# Altium schematic sheet Sheet1.SchDoc
size 594 x 420 mm; Author: ALTIUM GOSTBOM2.0 KEV; SheetNumber: 1; SheetTotal: 1
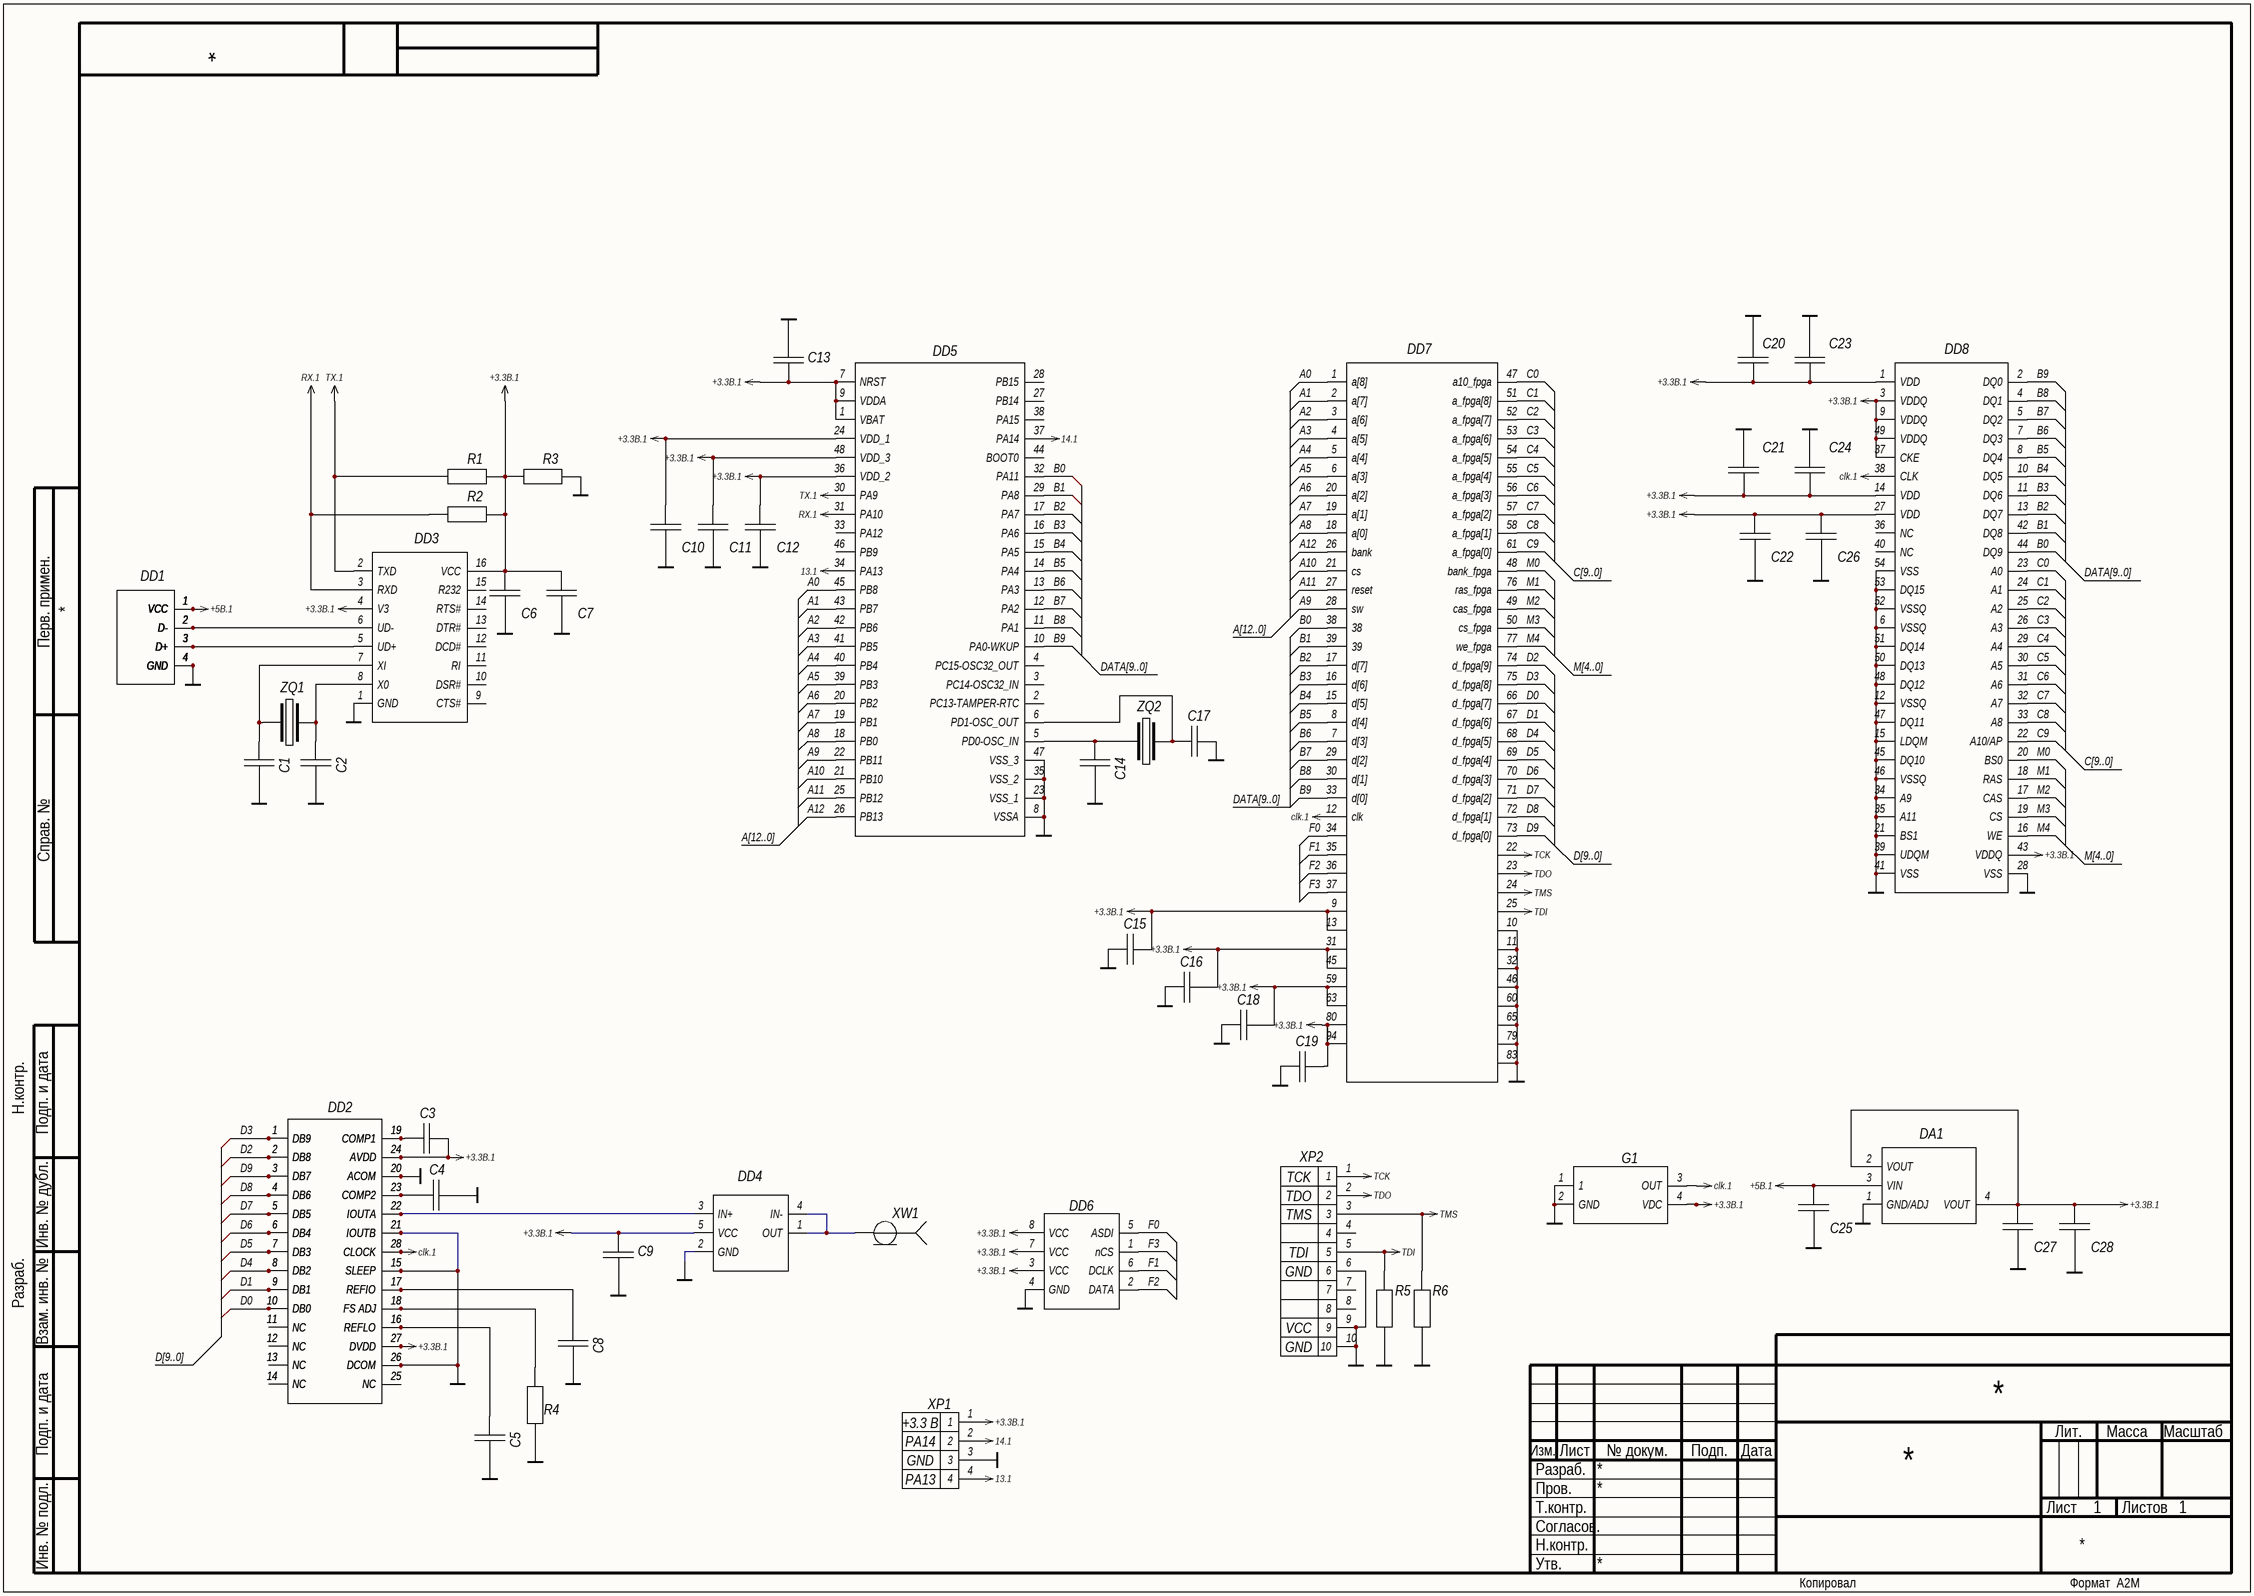
[diagram p0: Sheet1.SchDoc]

## Parts
C1  Обозначение при заказе  [CAP 0603_1608]  (value not drawn)
C2  Обозначение при заказе  [CAP 0603_1608]  (value not drawn)
C3  Обозначение при заказе  [CAP 0603_1608]  (value not drawn)
C4  Обозначение при заказе  [CAP 0603_1608]  (value not drawn)
C5  Обозначение при заказе  [CAP 0603_1608]  (value not drawn)
C6  Обозначение при заказе  [CAP 0603_1608]  (value not drawn)
C7  Обозначение при заказе  [CAP 0603_1608]  (value not drawn)
C8  Обозначение при заказе  [CAP 0603_1608]  (value not drawn)
C9  Обозначение при заказе  [CAP 0603_1608]  (value not drawn)
C10  Обозначение при заказе  [CAP 0603_1608]  (value not drawn)
C11  Обозначение при заказе  [CAP 0603_1608]  (value not drawn)
C12  Обозначение при заказе  [CAP 0603_1608]  (value not drawn)
C13  Обозначение при заказе  [CAP 0603_1608]  (value not drawn)
C14  Обозначение при заказе  [CAP 0603_1608]  (value not drawn)
C15  Обозначение при заказе  [CAP 0603_1608]  (value not drawn)
C16  Обозначение при заказе  [CAP 0603_1608]  (value not drawn)
C17  Обозначение при заказе  [CAP 0603_1608]  (value not drawn)
C18  Обозначение при заказе  [CAP 0603_1608]  (value not drawn)
C19  Обозначение при заказе  [CAP 0603_1608]  (value not drawn)
C20  Обозначение при заказе  [CAP 0603_1608]  (value not drawn)
C21  Обозначение при заказе  [CAP 0603_1608]  (value not drawn)
C22  Обозначение при заказе  [CAP 0603_1608]  (value not drawn)
C23  Обозначение при заказе  [CAP 0603_1608]  (value not drawn)
C24  Обозначение при заказе  [CAP 0603_1608]  (value not drawn)
C25  Обозначение при заказе  [CAP 0603_1608]  (value not drawn)
C26  Обозначение при заказе  [CAP 0603_1608]  (value not drawn)
C27  Обозначение при заказе  [CAP 0603_1608]  (value not drawn)
C28  Обозначение при заказе  [CAP 0603_1608]  (value not drawn)
DA1  Обозначение при заказе  [AMS1117-3.3 GENERATED]  (value not drawn)
DD1  USB  [USB]  (value not drawn)
DD2  Обозначение при заказе  [DAC]  (value not drawn)
DD3  Обозначение при заказе  [CH340G GENERATED]  (value not drawn)
DD4  AD8091  [SOT95P245X110-5N]  (value not drawn)
DD5  Обозначение при заказе  [LQFP-48]  (value not drawn)
DD6  Обозначение при заказе  [FLASH]  (value not drawn)
DD7  Обозначение при заказе  [QFP50P1600X1600X120-100N]  (value not drawn)
DD8  Обозначение при заказе  [SOP127P600-8N]  (value not drawn)
G1  Обозначение при заказе  [CAC-508P730X490-4N]  (value not drawn)
R1  Обозначение при заказе  [R_0805_T0.4]  (value not drawn)
R2  Обозначение при заказе  [R_0805_T0.4]  (value not drawn)
R3  Обозначение при заказе  [R_0805_T0.4]  (value not drawn)
R4  Обозначение при заказе  [R_0805_T0.4]  (value not drawn)
R5  Обозначение при заказе  [R_0805_T0.4]  (value not drawn)
R6  Обозначение при заказе  [R_0805_T0.4]  (value not drawn)
XP1  Обозначение при заказе  [4PIN]  (value not drawn)
XP2  Обозначение при заказе  [PINS]  (value not drawn)
XW1  Обозначение при заказе  [UHF]  (value not drawn)
ZQ1  Обозначение при заказе  [ECN-7U12000MAB143ZA3]  (value not drawn)
ZQ2  Обозначение при заказе  [ECN-7U12000MAB143ZA3]  (value not drawn)

## Nets
13.1: DD5.34(PA13) XP1.4
14.1: DD5.37(PA14) XP1.2
+3.3В.1: C3.2 C6.2 C7.2 C9.2 C10.2 C11.2 C12.2 C13.2 C15.2 C16.2 C18.2 C19.2 C20.2 C21.1 C22.2 C23.2 C24.1 C26.2 C27.2 C28.2 DA1.2(VOUT) DA1.4(VOUT) DD2.24(AVDD) DD2.27(DVDD) DD3.4(V3) DD3.16(VCC) DD4.5(VCC) DD5.1(VBAT) DD5.7(NRST) DD5.9(VDDA) DD5.24(VDD_1) DD5.36(VDD_2) DD5.48(VDD_3) DD6.3(VCC) DD6.7(VCC) DD6.8(VCC) DD7.9 DD7.13 DD7.31 DD7.45 DD7.59 DD7.63 DD7.80 DD7.94 DD8.1(VDD) DD8.3(VDDQ) DD8.9(VDDQ) DD8.14(VDD) DD8.27(VDD) DD8.37(CKE) DD8.43(VDDQ) DD8.49(VDDQ) G1.4(VDC) R1.2 R2.2 R3.1 XP1.1
+5В.1: C25.2 DA1.3(VIN) DD1.1(VCC)
clk.1: DD2.28(CLOCK) DD7.12(clk) DD8.38(CLK) G1.3(OUT)
GND: C1.2 C2.2 C4.2 C5.2 C6.1 C7.1 C8.2 C9.1 C10.1 C11.1 C12.1 C13.1 C14.2 C15.1 C16.1 C17.2 C18.1 C19.1 C20.1 C21.2 C22.1 C23.1 C24.2 C25.1 C26.1 C27.1 C28.1 DA1.1(GND/ADJ) DD1.4(GND) DD2.15(SLEEP) DD2.20(ACOM) DD2.21(IOUTB) DD2.26(DCOM) DD3.1(GND) DD4.2(GND) DD5.8(VSSA) DD5.23(VSS_1) DD5.35(VSS_2) DD5.47(VSS_3) DD6.4(GND) DD7.10 DD7.11 DD7.32 DD7.46 DD7.60 DD7.65 DD7.79 DD7.83 DD8.6(VSSQ) DD8.12(VSSQ) DD8.15(LDQM) DD8.21(BS1) DD8.28(VSS) DD8.34(A9) DD8.35(A11) DD8.39(UDQM) DD8.41(VSS) DD8.45(DQ10) DD8.46(VSSQ) DD8.47(DQ11) DD8.48(DQ12) DD8.50(DQ13) DD8.51(DQ14) DD8.52(VSSQ) DD8.53(DQ15) DD8.54(VSS) G1.1 G1.2(GND) R3.2 R4.2 R5.2 R6.2 XP1.3 XP2.6 XP2.9 XP2.10
RX.1: DD3.3(RXD) DD5.31(PA10) R2.1
TCK: DD7.22 XP2.1
TDI: DD7.25 R5.1 XP2.5
TDO: DD7.23 XP2.2
TMS: DD7.24 R6.1 XP2.3
TX.1: DD3.2(TXD) DD5.30(PA9) R1.1
A0: DD5.45(PB8) DD7.1(a[8])
A1: DD5.43(PB7) DD7.2(a[7])
A2: DD5.42(PB6) DD7.3(a[6])
A3: DD5.41(PB5) DD7.4(a[5])
A4: DD5.40(PB4) DD7.5(a[4])
A5: DD5.39(PB3) DD7.6(a[3])
A6: DD5.20(PB2) DD7.20(a[2])
A7: DD5.19(PB1) DD7.19(a[1])
A8: DD5.18(PB0) DD7.18(a[0])
A9: DD5.22(PB11) DD7.28(sw)
A10: DD5.21(PB10) DD7.21(cs)
A11: DD5.25(PB12) DD7.27(reset)
A12: DD5.26(PB13) DD7.26(bank)
B0: DD5.32(PA11) DD7.38 DD8.44(DQ9)
B1: DD5.29(PA8) DD7.39 DD8.42(DQ8)
B2: DD5.17(PA7) DD7.17(d[7]) DD8.13(DQ7)
B3: DD5.16(PA6) DD7.16(d[6]) DD8.11(DQ6)
B4: DD5.15(PA5) DD7.15(d[5]) DD8.10(DQ5)
B5: DD5.14(PA4) DD7.8(d[4]) DD8.8(DQ4)
B6: DD5.13(PA3) DD7.7(d[3]) DD8.7(DQ3)
B7: DD5.12(PA2) DD7.29(d[2]) DD8.5(DQ2)
B8: DD5.11(PA1) DD7.30(d[1]) DD8.4(DQ1)
B9: DD5.10(PA0-WKUP) DD7.33(d[0]) DD8.2(DQ0)
C0: DD7.47(a10_fpga) DD8.23(A0)
C1: DD7.51(a_fpga[8]) DD8.24(A1)
C2: DD7.52(a_fpga[7]) DD8.25(A2)
C3: DD7.53(a_fpga[6]) DD8.26(A3)
C4: DD7.54(a_fpga[5]) DD8.29(A4)
C5: DD7.55(a_fpga[4]) DD8.30(A5)
C6: DD7.56(a_fpga[3]) DD8.31(A6)
C7: DD7.57(a_fpga[2]) DD8.32(A7)
C8: DD7.58(a_fpga[1]) DD8.33(A8)
C9: DD7.61(a_fpga[0]) DD8.22(A10/AP)
D0: DD2.10(DB0) DD7.66(d_fpga[7])
D1: DD2.9(DB1) DD7.67(d_fpga[6])
D2: DD2.2(DB8) DD7.74(d_fpga[9])
D3: DD2.1(DB9) DD7.75(d_fpga[8])
D4: DD2.8(DB2) DD7.68(d_fpga[5])
D5: DD2.7(DB3) DD7.69(d_fpga[4])
D6: DD2.6(DB4) DD7.70(d_fpga[3])
D7: DD2.5(DB5) DD7.71(d_fpga[2])
D8: DD2.4(DB6) DD7.72(d_fpga[1])
D9: DD2.3(DB7) DD7.73(d_fpga[0])
F0: DD6.5(ASDI) DD7.34
F1: DD6.6(DCLK) DD7.35
F2: DD6.2(DATA) DD7.36
F3: DD6.1(nCS) DD7.37
M0: DD7.48(bank_fpga) DD8.20(BS0)
M1: DD7.76(ras_fpga) DD8.18(RAS)
M2: DD7.49(cas_fpga) DD8.17(CAS)
M3: DD7.50(cs_fpga) DD8.19(CS)
M4: DD7.77(we_fpga) DD8.16(WE)
NetC1_1: C1.1 DD3.7(XI) ZQ1.1
NetC2_1: C2.1 DD3.8(X0) ZQ1.2
NetC3_1: C3.1 DD2.19(COMP1)
NetC4_1: C4.1 DD2.23(COMP2)
NetC5_1: C5.1 DD2.16(REFLO)
NetC8_1: C8.1 DD2.17(REFIO)
NetC14_1: C14.1 DD5.5(PD0-OSC_IN) ZQ2.1
NetC17_1: C17.1 DD5.6(PD1-OSC_OUT) ZQ2.2
NetDD1_2: DD1.2(D-) DD3.6(UD-)
NetDD1_3: DD1.3(D+) DD3.5(UD+)
NetDD2_18: DD2.18(FS_ADJ) R4.1
NetDD2_22: DD2.22(IOUTA) DD4.3(IN+)
NetDD4_1: DD4.1(OUT) DD4.4(IN-) XW1.1

Not connected (* = marked no-connect by the designer): DD2 11(NC) 12(NC) 13(NC) 14(NC) 25(NC); DD3 9(CTS#) 10(DSR#) 11(RI) 12(DCD#) 13(DTR#) 14(RTS#) 15(R232); DD5 2(PC13-TAMPER-RTC) 3(PC14-OSC32_IN) 4(PC15-OSC32_OUT) 27(PB14) 28(PB15) 33(PA12) 38(PA15) 44(BOOT0) 46(PB9); DD8 36(NC) 40(NC); XP2 4 7 8

## Buses and harness runs
bus A[12..0]
bus C[9..0]
bus D[9..0]
bus DATA[9..0]
bus M[4..0]

## Notes on the sheet
- Перв. примен.
- Справ. №
- Н.контр.
- Подп. и дата
- Инв. № дубл.
- Разраб.
- Взам. инв. №
- Изм.
- Лист
- № докум.
- Подп.
- Дата
- Лит.
- Масса
- Масштаб
- Пров.
- Т.контр.
- Листов
- Инв. № подл.
- Утв.
- Согласов.
- Копировал
- Формат  A2М
- (in symbol 4PINS) +3.3 В; PA14; GND; PA13
- (in symbol 10PINS) TCK; TDO; TMS; TDI; GND; VCC

## Library data of the parts
C1-C28 = CAP: Описание свойств компонента; Component: Capacitor; Model: ?; Link: ?
DA1 = AMS1117-3.3: Описание свойств компонента; Component: Стабилизатор; Model: AMS1117-3.3; ComponentLink1Description: New link; ComponentLink1URL: https://www.chipdip.ru/product/ams1117-3.3; Link: https://www.chipdip.ru/product/ams1117-3.3
DD1 = USB: Model: Unknown; Component: USB; ComponentLink1Description: Link; ComponentLink1URL: No link; Link: No link
DD2 = DAC: Описание свойств компонента; Model: AD9760ARUZ50; Component: DAC; ComponentLink1Description: New link; ComponentLink1URL: https://www.chipdip.ru/product/ad9760aruz50; Link: https://www.chipdip.ru/product/ad9760aruz50
DD3 = ch340: Описание свойств компонента; Component: UART INTERFACE; Model: CH340G; ComponentLink1Description: New link; ComponentLink1URL: https://cdn.sparkfun.com/datasheets/Dev/Arduino/Other/CH340DS1.PDF; Link: https://cdn.sparkfun.com/datasheets/Dev/Arduino/Other/CH340DS1.PDF
DD4 = ad8091: SOT-23-5
DD5 = STM32: Описание свойств компонента; Component: Controller; Model: STM32F446RET6; ComponentLink1Description: Link; ComponentLink1URL: https://www.chipdip.ru/product/stm32f446ret6; Link: https://www.chipdip.ru/product/stm32f446ret6
DD6 = FLASH: Описание свойств компонента; Component: FLASH Memory; Model: EPCS16SI8N; ComponentLink1Description: New link; ComponentLink1URL: https://www.chipdip.ru/product/epcs16si8n; Link: https://www.chipdip.ru/product/epcs16si8n
DD7 = FPGA: Описание свойств компонента; Model: Altera II EPM240T100C3; Component: FPGA; ComponentLink1Description: New link; ComponentLink1URL: https://eu.mouser.com/ProductDetail/Intel-Altera/EPM240T100C3?qs=jblrfmjbeiFZviQiVyzREw%3D%3D; Link: https://eu.mouser.com/ProductDetail/Intel-Altera/EPM240T100C3?qs=jblrfmjbeiFZviQiVyzREw%3D%3D
DD8 = MEM: Описание свойств компонента; Component: Memory; Model: W9812G6KH-6/TRAY; ComponentLink1Description: Link; ComponentLink1URL: https://www.chipdip.ru/product/w9812g6kh-6-tray; Link: https://www.chipdip.ru/product/w9812g6kh-6-tray
G1 = fpRESONATOR: Описание свойств компонента; Component: FPGA Quartz Generator; Model: https://www.chipdip.ru/product0/8004154941; Link: https://www.chipdip.ru/product0/8004154941
R1-R6 = RES: Описание свойств компонента; Component: Resistor; Model: ?; Link: ?
XP1 = 4PINS: Описание свойств компонента; Model: PLS-4 (DS-1021-1x4); Component: Вилка штыревая 4PIN; Link: https://www.chipdip.ru/product/pls-4; ComponentLink1Description: New link; ComponentLink1URL: https://www.chipdip.ru/product/pls-4
XP2 = 10PINS: Описание свойств компонента; Model: PLD-10 (DS1021-2x5); Component: Вилка штыревая 10PIN; Link: https://www.chipdip.ru/product/pld-10; ComponentLink1Description: New link; ComponentLink1URL: https://www.chipdip.ru/product/pld-10
XW1 = UHF PORT: Описание свойств компонента; Component: СВЧ разъем; Model: KLS1-SMA002-B; ComponentLink1Description: New link; ComponentLink1URL: https://www.chipdip.ru/product/kls1-sma002-b-sma-jr; Link: https://www.chipdip.ru/product/kls1-sma002-b-sma-jr
ZQ1 = Quartz: Описание свойств компонента; Component: Quartz resonator; Model: ECN-7U12000MAB143ZA3; Link: ?
ZQ2 = Quartz: Описание свойств компонента; Component: Quartz resonator; Model: ECN-7U16000M9Z143ZA3; Link: ?